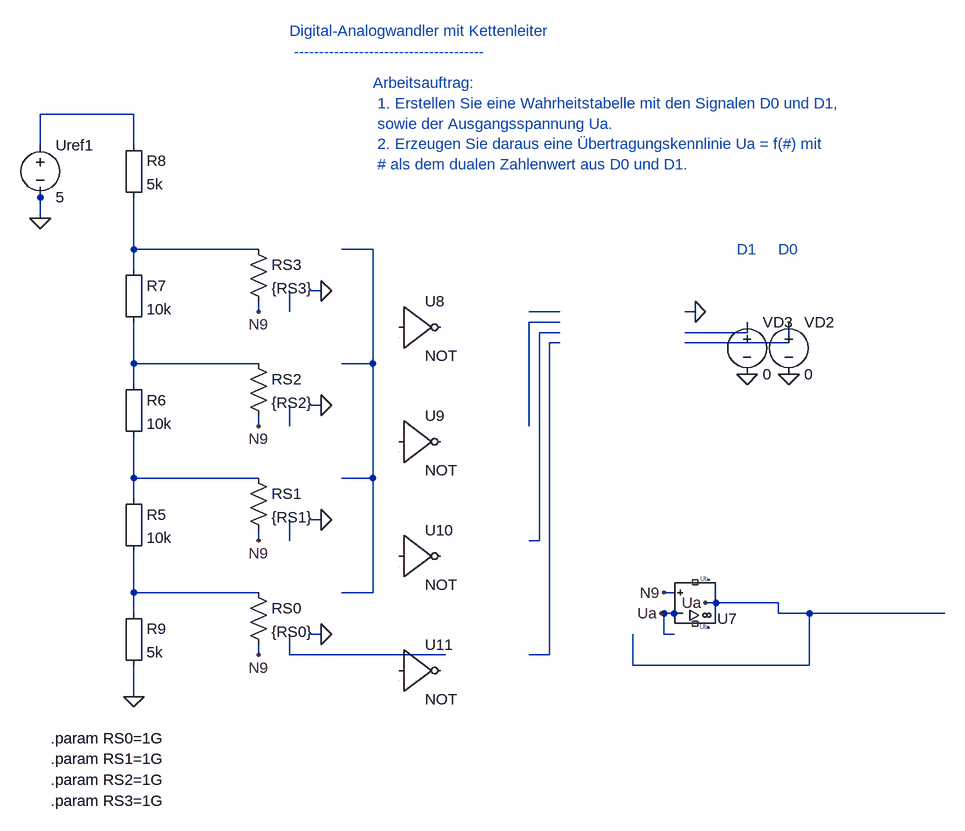
[diagram p0: schematic 8_1_1_DAC_mit_Kettenleiter.asc]
8_1_1_DAC_mit_Kettenleiter.asc, the LTspice schematic file:
Version 4
SHEET 1 880 680
WIRE 48 304 48 288
WIRE 1024 944 1008 944
WIRE 1008 944 1008 976
WIRE 1008 976 1024 976
WIRE 1088 928 1184 928
WIRE 1184 928 1184 944
WIRE 48 336 48 288
WIRE 192 304 192 384
WIRE 192 672 192 736
WIRE 192 384 192 416
WIRE 384 384 192 384
WIRE 192 496 192 560
WIRE 192 736 192 768
WIRE 384 736 192 736
WIRE 192 848 192 912
WIRE 480 976 464 976
WIRE 480 800 464 800
WIRE 192 560 192 592
WIRE 384 560 192 560
WIRE 480 624 464 624
WIRE 480 448 464 448
WIRE 512 912 560 912
WIRE 512 736 560 736
WIRE 512 560 560 560
WIRE 192 224 192 176
WIRE 192 176 48 176
WIRE 48 176 48 224
WIRE 560 560 560 736
WIRE 512 384 560 384
WIRE 560 384 560 560
WIRE 432 480 432 448
WIRE 432 656 432 624
WIRE 432 832 432 800
WIRE 672 1008 432 1008
WIRE 432 1008 432 976
WIRE 1056 480 1040 480
WIRE 848 480 800 480
WIRE 848 496 800 496
WIRE 800 496 800 656
WIRE 848 512 816 512
WIRE 816 512 816 832
WIRE 816 832 800 832
WIRE 848 528 832 528
WIRE 832 528 832 1008
WIRE 832 1008 800 1008
WIRE 192 912 384 912
WIRE 192 1072 192 1024
WIRE 960 976 960 1024
WIRE 960 1024 1232 1024
WIRE 1232 1024 1232 944
WIRE 560 912 560 736
WIRE 1232 944 1184 944
WIRE 1440 944 1232 944
WIRE 192 944 192 912
WIRE 1040 512 1136 512
WIRE 1136 512 1136 496
WIRE 1040 528 1200 528
WIRE 1200 528 1200 496
WIRE 384 992 384 1008
WIRE 384 816 384 832
WIRE 384 640 384 656
WIRE 384 464 384 480
WIRE 1024 912 1008 912
WIRE 1088 928 1072 928
WIRE 1024 944 1004 944
FLAG 1200 576 0
FLAG 1136 576 0
FLAG 48 336 0
FLAG 192 1072 0
FLAG 480 976 0
FLAG 480 800 0
FLAG 480 624 0
FLAG 480 448 0
FLAG 1056 480 0
FLAG 48 336 0
FLAG 192 1072 0
FLAG 480 976 0
FLAG 480 800 0
FLAG 480 624 0
FLAG 480 448 0
FLAG 1056 480 0
FLAG 384 1008 N9
FLAG 384 832 N9
FLAG 384 656 N9
FLAG 384 480 N9
FLAG 1008 912 N9
FLAG 1072 928 Ua
FLAG 1004 944 Ua
SYMBOL voltage 48 208 R0
SYMATTR InstName Uref1
SYMATTR Value 5
SYMBOL Misc\EuropeanResistor 176 752 R0
SYMATTR InstName R5
SYMATTR Value 10k
SYMBOL UniversalOpAmp2 1056 928 M180
SYMATTR InstName U7
SYMATTR Value UniversalOpAmp2
SYMBOL Misc\EuropeanResistor 176 576 R0
SYMATTR InstName R6
SYMATTR Value 10k
SYMBOL Misc\EuropeanResistor 176 400 R0
SYMATTR InstName R7
SYMATTR Value 10k
SYMBOL Misc\EuropeanResistor 176 208 R0
SYMATTR InstName R8
SYMATTR Value 5k
SYMBOL res 368 896 R0
SYMATTR InstName RS0
SYMATTR Value {RS0}
SYMBOL res 368 720 R0
SYMATTR InstName RS1
SYMATTR Value {RS1}
SYMBOL res 368 544 R0
SYMATTR InstName RS2
SYMATTR Value {RS2}
SYMBOL res 368 368 R0
SYMATTR InstName RS3
SYMATTR Value {RS3}
SYMBOL Digital\inv 600 440 R0
SYMATTR InstName U8
SYMATTR Value NOT
SYMATTR LibreSpice gate=not;inputs=1;vth=2.5;vhigh=5;pins=In1,Out
SYMBOL Digital\inv 600 616 R0
SYMATTR InstName U9
SYMATTR Value NOT
SYMATTR LibreSpice gate=not;inputs=1;vth=2.5;vhigh=5;pins=In1,Out
SYMBOL Digital\inv 600 792 R0
SYMATTR InstName U10
SYMATTR Value NOT
SYMATTR LibreSpice gate=not;inputs=1;vth=2.5;vhigh=5;pins=In1,Out
SYMBOL Digital\inv 600 968 R0
SYMATTR InstName U11
SYMATTR Value NOT
SYMATTR LibreSpice gate=not;inputs=1;vth=2.5;vhigh=5;pins=In1,Out
SYMBOL Misc\EuropeanResistor 176 928 R0
SYMATTR InstName R9
SYMATTR Value 5k
SYMBOL voltage 1200 480 R0
SYMATTR InstName VD2
SYMATTR Value 0
SYMBOL voltage 1136 480 R0
SYMATTR InstName VD3
SYMATTR Value 0
TEXT 64 1136 Left 2 !.param RS0=1G
TEXT 64 1168 Left 2 !.param RS1=1G
TEXT 64 1200 Left 2 !.param RS2=1G
TEXT 64 1232 Left 2 !.param RS3=1G
TEXT 432 48 Left 2 ;Digital-Analogwandler mit Kettenleiter \n --------------------------------------
TEXT 560 128 Left 2 ;Arbeitsauftrag: \n 1. Erstellen Sie eine Wahrheitstabelle mit den Signalen D0 und D1, \n sowie der Ausgangsspannung Ua. \n 2. Erzeugen Sie daraus eine Übertragungskennlinie Ua = f(#) mit \n # als dem dualen Zahlenwert aus D0 und D1.
TEXT 1184 384 Left 2 ;D0
TEXT 1120 384 Left 2 ;D1

The netlist it stands for:
* 8_1_1_DAC_mit_Kettenleiter.asc
V§Uref1 N006 0 5
R5 N002 N004 10k
XU7 N9 Ua NC_01 NC_02 Ua level2 UniversalOpAmp2 Avol=1Meg GBW=10Meg Slew=10Meg Ilimit=25m Rail=0 Vos=0 En=0 Enk=0 In=0 Ink=0 Rin=500Meg  ; pins In+ In- V+ V- OUT
R6 N003 N002 10k
R7 N001 N003 10k
R8 N006 N001 5k
RS0 N004 N9 {RS0}
RS1 N002 N9 {RS1}
RS2 N003 N9 {RS2}
RS3 N001 N9 {RS3}
A§U8 0 0 0 0 0 0 0 0 BUF NOT
A§U9 0 0 0 0 0 0 0 0 BUF NOT
A§U10 0 0 0 0 0 0 0 0 BUF NOT
A§U11 0 0 0 0 0 0 0 0 BUF NOT
R9 N004 0 5k
VD2 N016 0 0
VD3 N015 0 0
.param RS0=1G
.param RS1=1G
.param RS2=1G
.param RS3=1G
* Digital-Analogwandler mit Kettenleiter
*  --------------------------------------
* Arbeitsauftrag:
*  1. Erstellen Sie eine Wahrheitstabelle mit den Signalen D0 und D1,
*  sowie der Ausgangsspannung Ua.
*  2. Erzeugen Sie daraus eine Übertragungskennlinie Ua = f(#) mit
*  # als dem dualen Zahlenwert aus D0 und D1.
* D0
* D1
.lib UniversalOpAmp2.lib
.backanno
.end